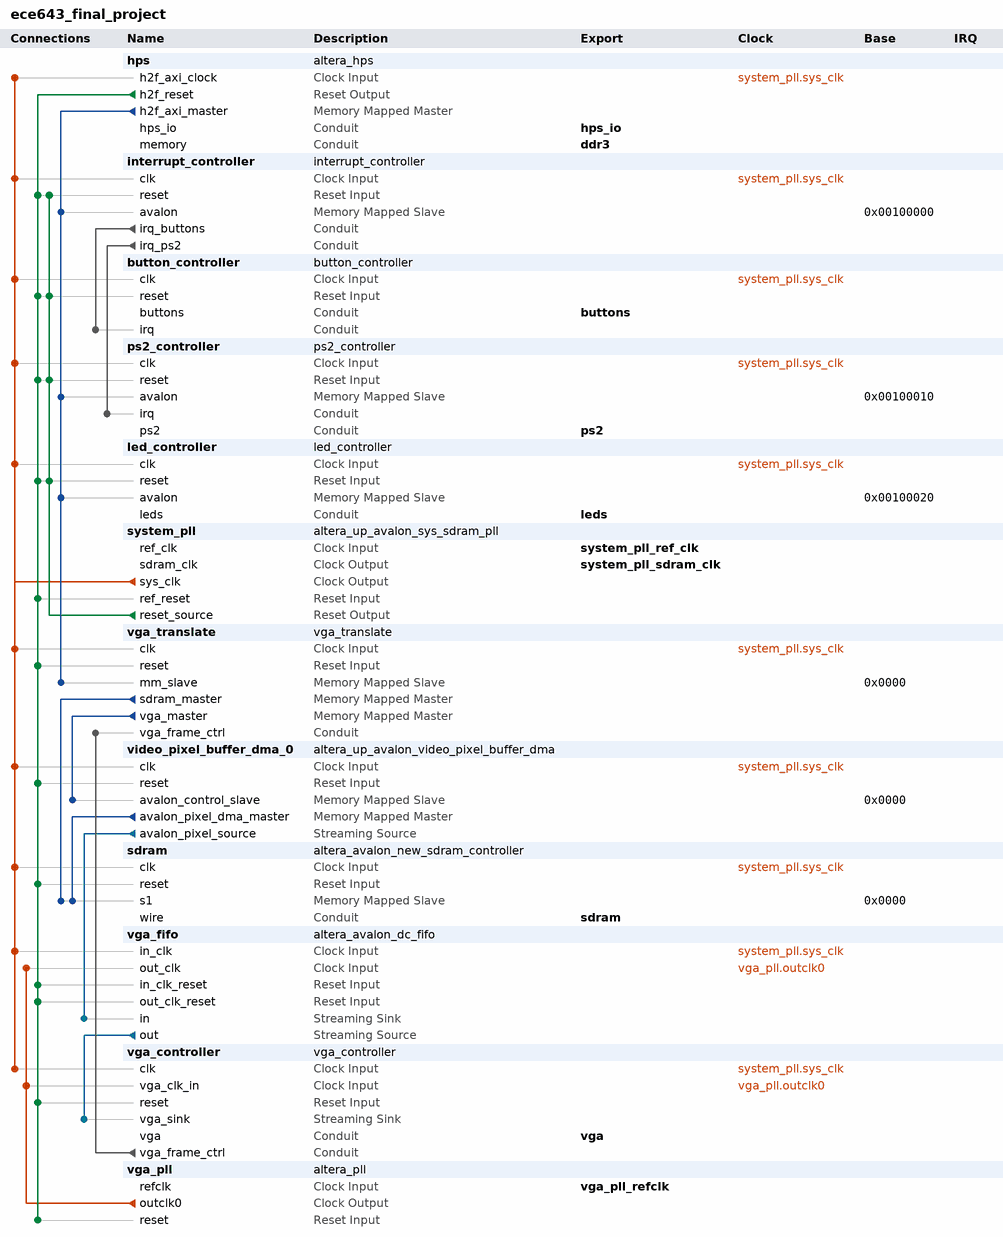
[diagram p0: system contents]
# Platform Designer (Qsys) system ece643_final_project, Cyclone V 5CSEMA5F31C6
# Parameters at their usual value, and those the tool derives, are not listed.
package require -exact qsys 20.1
create_system ece643_final_project
set_project_property DEVICE_FAMILY {Cyclone V}
set_project_property DEVICE 5CSEMA5F31C6

add_instance hps altera_hps 20.1
set_instance_parameter_value hps EMAC1_Mode RGMII
set_instance_parameter_value hps EMAC1_PinMuxing {HPS I/O Set 0}
set_instance_parameter_value hps F2SCLK_COLDRST_Enable false
set_instance_parameter_value hps F2SCLK_DBGRST_Enable false
set_instance_parameter_value hps F2SCLK_WARMRST_Enable false
set_instance_parameter_value hps F2SINTERRUPT_Enable false
set_instance_parameter_value hps F2S_Width 0
set_instance_parameter_value hps FPGA_PERIPHERAL_OUTPUT_CLOCK_FREQ_EMAC0_GTX_CLK 125
set_instance_parameter_value hps FPGA_PERIPHERAL_OUTPUT_CLOCK_FREQ_EMAC0_MD_CLK 2.5
set_instance_parameter_value hps FPGA_PERIPHERAL_OUTPUT_CLOCK_FREQ_EMAC1_GTX_CLK 125
set_instance_parameter_value hps FPGA_PERIPHERAL_OUTPUT_CLOCK_FREQ_EMAC1_MD_CLK 2.5
set_instance_parameter_value hps HPS_PROTOCOL DDR3
set_instance_parameter_value hps I2C0_Mode I2C
set_instance_parameter_value hps I2C0_PinMuxing {HPS I/O Set 0}
set_instance_parameter_value hps I2C1_Mode I2C
set_instance_parameter_value hps I2C1_PinMuxing {HPS I/O Set 0}
set_instance_parameter_value hps LWH2F_Enable false
set_instance_parameter_value hps MEM_BANKADDR_WIDTH 3
set_instance_parameter_value hps MEM_CLK_FREQ 370.0
set_instance_parameter_value hps MEM_COL_ADDR_WIDTH 10
set_instance_parameter_value hps MEM_DQ_WIDTH 32
set_instance_parameter_value hps MEM_DRV_STR RZQ/7
set_instance_parameter_value hps MEM_ROW_ADDR_WIDTH 15
set_instance_parameter_value hps MEM_RTT_NOM RZQ/4
set_instance_parameter_value hps MEM_RTT_WR RZQ/4
set_instance_parameter_value hps MEM_TCL 11
set_instance_parameter_value hps MEM_TFAW_NS 30.0
set_instance_parameter_value hps MEM_TRAS_NS 35.0
set_instance_parameter_value hps MEM_TRCD_NS 13.75
set_instance_parameter_value hps MEM_TRFC_NS 260.0
set_instance_parameter_value hps MEM_TRP_NS 13.75
set_instance_parameter_value hps MEM_VENDOR JEDEC
set_instance_parameter_value hps MEM_WTCL 8
set_instance_parameter_value hps QSPI_Mode {1 SS}
set_instance_parameter_value hps QSPI_PinMuxing {HPS I/O Set 0}
set_instance_parameter_value hps REF_CLK_FREQ 25.0
set_instance_parameter_value hps S2FCLK_USER2CLK 5
set_instance_parameter_value hps S2F_Width 2
set_instance_parameter_value hps SDIO_Mode {4-bit Data}
set_instance_parameter_value hps SDIO_PinMuxing {HPS I/O Set 0}
set_instance_parameter_value hps SPIM1_Mode {Single Slave Select}
set_instance_parameter_value hps SPIM1_PinMuxing {HPS I/O Set 0}
set_instance_parameter_value hps STM_Enable false
set_instance_parameter_value hps TIMING_BOARD_AC_SKEW 0.03
set_instance_parameter_value hps TIMING_BOARD_AC_TO_CK_SKEW 0.0
set_instance_parameter_value hps TIMING_BOARD_DQ_TO_DQS_SKEW 0.0
set_instance_parameter_value hps TIMING_BOARD_MAX_CK_DELAY 0.03
set_instance_parameter_value hps TIMING_BOARD_MAX_DQS_DELAY 0.02
set_instance_parameter_value hps TIMING_BOARD_SKEW_BETWEEN_DQS 0.08
set_instance_parameter_value hps TIMING_BOARD_SKEW_CKDQS_DIMM_MAX 0.16
set_instance_parameter_value hps TIMING_BOARD_SKEW_CKDQS_DIMM_MIN 0.09
set_instance_parameter_value hps TIMING_BOARD_SKEW_WITHIN_DQS 0.01
set_instance_parameter_value hps TIMING_TDH 65
set_instance_parameter_value hps TIMING_TDQSCK 255
set_instance_parameter_value hps TIMING_TDQSQ 125
set_instance_parameter_value hps TIMING_TDS 30
set_instance_parameter_value hps TIMING_TIH 140
set_instance_parameter_value hps TIMING_TIS 180
set_instance_parameter_value hps TIMING_TQSH 0.4
set_instance_parameter_value hps UART0_Mode {No Flow Control}
set_instance_parameter_value hps UART0_PinMuxing {HPS I/O Set 0}
set_instance_parameter_value hps USB1_Mode SDR
set_instance_parameter_value hps USB1_PinMuxing {HPS I/O Set 0}
set_instance_parameter_value hps desired_cfg_clk_mhz 97.368421
set_instance_parameter_value hps desired_qspi_clk_mhz 370.0

add_instance interrupt_controller interrupt_controller 1.0

add_instance button_controller button_controller 1.0

add_instance ps2_controller ps2_controller 1.0

add_instance led_controller led_controller 1.0

add_instance system_pll altera_up_avalon_sys_sdram_pll 18.0
set_instance_parameter_value system_pll CV_boards DE1-SoC
set_instance_parameter_value system_pll gui_outclk 97.368421
set_instance_parameter_value system_pll gui_refclk 50.0

add_instance vga_translate vga_translate 1.0

add_instance video_pixel_buffer_dma_0 altera_up_avalon_video_pixel_buffer_dma 18.0
set_instance_parameter_value video_pixel_buffer_dma_0 addr_mode X-Y
set_instance_parameter_value video_pixel_buffer_dma_0 back_start_address 0
set_instance_parameter_value video_pixel_buffer_dma_0 color_space {16-bit RGB}
set_instance_parameter_value video_pixel_buffer_dma_0 image_height 480
set_instance_parameter_value video_pixel_buffer_dma_0 image_width 640
set_instance_parameter_value video_pixel_buffer_dma_0 start_address 0

add_instance sdram altera_avalon_new_sdram_controller 20.1
set_instance_parameter_value sdram TAC 5.5
set_instance_parameter_value sdram TRCD 20.0
set_instance_parameter_value sdram TRP 20.0
set_instance_parameter_value sdram casLatency 3
set_instance_parameter_value sdram columnWidth 10
set_instance_parameter_value sdram dataWidth 16
set_instance_parameter_value sdram generateSimulationModel false
set_instance_parameter_value sdram model single_Micron_MT48LC4M32B2_7_chip
set_instance_parameter_value sdram numberOfBanks 4
set_instance_parameter_value sdram numberOfChipSelects 1
set_instance_parameter_value sdram powerUpDelay 100.0
set_instance_parameter_value sdram refreshPeriod 15.625
set_instance_parameter_value sdram rowWidth 13

add_instance vga_fifo altera_avalon_dc_fifo 20.1
set_instance_parameter_value vga_fifo BITS_PER_SYMBOL 16
set_instance_parameter_value vga_fifo FIFO_DEPTH 128
set_instance_parameter_value vga_fifo USE_PACKETS 1

add_instance vga_controller vga_controller 1.0

add_instance vga_pll altera_pll 20.1
set_instance_parameter_value vga_pll gui_device_speed_grade 1
set_instance_parameter_value vga_pll gui_number_of_clocks 1
set_instance_parameter_value vga_pll gui_operation_mode direct
set_instance_parameter_value vga_pll gui_output_clock_frequency0 25.0
set_instance_parameter_value vga_pll gui_pll_mode {Integer-N PLL}
set_instance_parameter_value vga_pll gui_reference_clock_frequency 50.0
set_instance_parameter_value vga_pll gui_use_locked false

# connections
add_connection system_pll.sys_clk button_controller.clk clock
add_connection system_pll.sys_clk hps.h2f_axi_clock clock
add_connection system_pll.sys_clk interrupt_controller.clk clock
add_connection system_pll.sys_clk led_controller.clk clock
add_connection system_pll.sys_clk ps2_controller.clk clock
add_connection system_pll.sys_clk sdram.clk clock
add_connection system_pll.sys_clk vga_controller.clk clock
add_connection system_pll.sys_clk vga_fifo.in_clk clock
add_connection system_pll.sys_clk vga_translate.clk clock
add_connection system_pll.sys_clk video_pixel_buffer_dma_0.clk clock
add_connection vga_pll.outclk0 vga_controller.vga_clk_in clock
add_connection vga_pll.outclk0 vga_fifo.out_clk clock
add_connection hps.h2f_reset button_controller.reset reset
add_connection hps.h2f_reset interrupt_controller.reset reset
add_connection hps.h2f_reset led_controller.reset reset
add_connection hps.h2f_reset ps2_controller.reset reset
add_connection hps.h2f_reset sdram.reset reset
add_connection hps.h2f_reset system_pll.ref_reset reset
add_connection hps.h2f_reset vga_controller.reset reset
add_connection hps.h2f_reset vga_fifo.in_clk_reset reset
add_connection hps.h2f_reset vga_fifo.out_clk_reset reset
add_connection hps.h2f_reset vga_pll.reset reset
add_connection hps.h2f_reset vga_translate.reset reset
add_connection hps.h2f_reset video_pixel_buffer_dma_0.reset reset
add_connection system_pll.reset_source button_controller.reset reset
add_connection system_pll.reset_source interrupt_controller.reset reset
add_connection system_pll.reset_source led_controller.reset reset
add_connection system_pll.reset_source ps2_controller.reset reset
add_connection hps.h2f_axi_master interrupt_controller.avalon avalon
set_connection_parameter_value hps.h2f_axi_master/interrupt_controller.avalon baseAddress 0x00100000
add_connection hps.h2f_axi_master led_controller.avalon avalon
set_connection_parameter_value hps.h2f_axi_master/led_controller.avalon baseAddress 0x00100020
add_connection hps.h2f_axi_master ps2_controller.avalon avalon
set_connection_parameter_value hps.h2f_axi_master/ps2_controller.avalon baseAddress 0x00100010
add_connection hps.h2f_axi_master vga_translate.mm_slave avalon
set_connection_parameter_value hps.h2f_axi_master/vga_translate.mm_slave baseAddress 0x0000
add_connection vga_translate.sdram_master sdram.s1 avalon
set_connection_parameter_value vga_translate.sdram_master/sdram.s1 baseAddress 0x0000
add_connection vga_translate.vga_master video_pixel_buffer_dma_0.avalon_control_slave avalon
set_connection_parameter_value vga_translate.vga_master/video_pixel_buffer_dma_0.avalon_control_slave baseAddress 0x0000
add_connection video_pixel_buffer_dma_0.avalon_pixel_dma_master sdram.s1 avalon
set_connection_parameter_value video_pixel_buffer_dma_0.avalon_pixel_dma_master/sdram.s1 baseAddress 0x0000
add_connection vga_fifo.out vga_controller.vga_sink avalon_streaming
add_connection video_pixel_buffer_dma_0.avalon_pixel_source vga_fifo.in avalon_streaming
add_connection interrupt_controller.irq_buttons button_controller.irq conduit
add_connection interrupt_controller.irq_ps2 ps2_controller.irq conduit
add_connection vga_controller.vga_frame_ctrl vga_translate.vga_frame_ctrl conduit

# exported interfaces
add_interface buttons conduit end
set_interface_property buttons EXPORT_OF button_controller.buttons
add_interface ddr3 conduit end
set_interface_property ddr3 EXPORT_OF hps.memory
add_interface hps_io conduit end
set_interface_property hps_io EXPORT_OF hps.hps_io
add_interface leds conduit end
set_interface_property leds EXPORT_OF led_controller.leds
add_interface ps2 conduit end
set_interface_property ps2 EXPORT_OF ps2_controller.ps2
add_interface sdram conduit end
set_interface_property sdram EXPORT_OF sdram.wire
add_interface system_pll_ref_clk clock sink
set_interface_property system_pll_ref_clk EXPORT_OF system_pll.ref_clk
add_interface system_pll_sdram_clk clock source
set_interface_property system_pll_sdram_clk EXPORT_OF system_pll.sdram_clk
add_interface vga conduit end
set_interface_property vga EXPORT_OF vga_controller.vga
add_interface vga_pll_refclk clock sink
set_interface_property vga_pll_refclk EXPORT_OF vga_pll.refclk

set_interconnect_requirement {$system} qsys_mm.clockCrossingAdapter HANDSHAKE
set_interconnect_requirement {$system} qsys_mm.enableEccProtection FALSE
set_interconnect_requirement {$system} qsys_mm.insertDefaultSlave FALSE
set_interconnect_requirement {$system} qsys_mm.maxAdditionalLatency 1

save_system ece643_final_project.qsys
